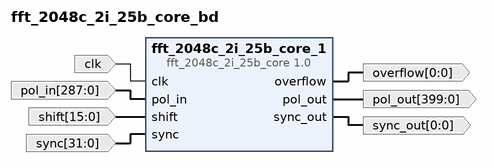
[diagram p0: block diagram of the top level]
# Vivado block design fft_2048c_2i_25b_core_bd, xczu49dr-ffvf1760-2-e, Vivado 2020.2
create_bd_design fft_2048c_2i_25b_core_bd

create_bd_port -dir I -type clk clk
create_bd_port -dir O -from 0 -to 0 -type data overflow
create_bd_port -dir I -from 287 -to 0 -type data pol_in
create_bd_port -dir O -from 399 -to 0 -type data pol_out
create_bd_port -dir I -from 15 -to 0 -type data shift
create_bd_port -dir I -from 31 -to 0 -type data sync
create_bd_port -dir O -from 0 -to 0 -type data sync_out

create_bd_cell -type ip -vlnv User_Company:SysGen:fft_2048c_2i_25b_core:1.0 fft_2048c_2i_25b_core_1

# ---- connections ----

connect_bd_net [get_bd_ports clk] [get_bd_pins fft_2048c_2i_25b_core_1/clk]
connect_bd_net [get_bd_pins fft_2048c_2i_25b_core_1/overflow] [get_bd_ports overflow]
connect_bd_net [get_bd_ports pol_in] [get_bd_pins fft_2048c_2i_25b_core_1/pol_in]
connect_bd_net [get_bd_pins fft_2048c_2i_25b_core_1/pol_out] [get_bd_ports pol_out]
connect_bd_net [get_bd_ports shift] [get_bd_pins fft_2048c_2i_25b_core_1/shift]
connect_bd_net [get_bd_ports sync] [get_bd_pins fft_2048c_2i_25b_core_1/sync]
connect_bd_net [get_bd_pins fft_2048c_2i_25b_core_1/sync_out] [get_bd_ports sync_out]

validate_bd_design
save_bd_design
